# EAGLE schematic RH013.1 (EAGLE 7.1.0)
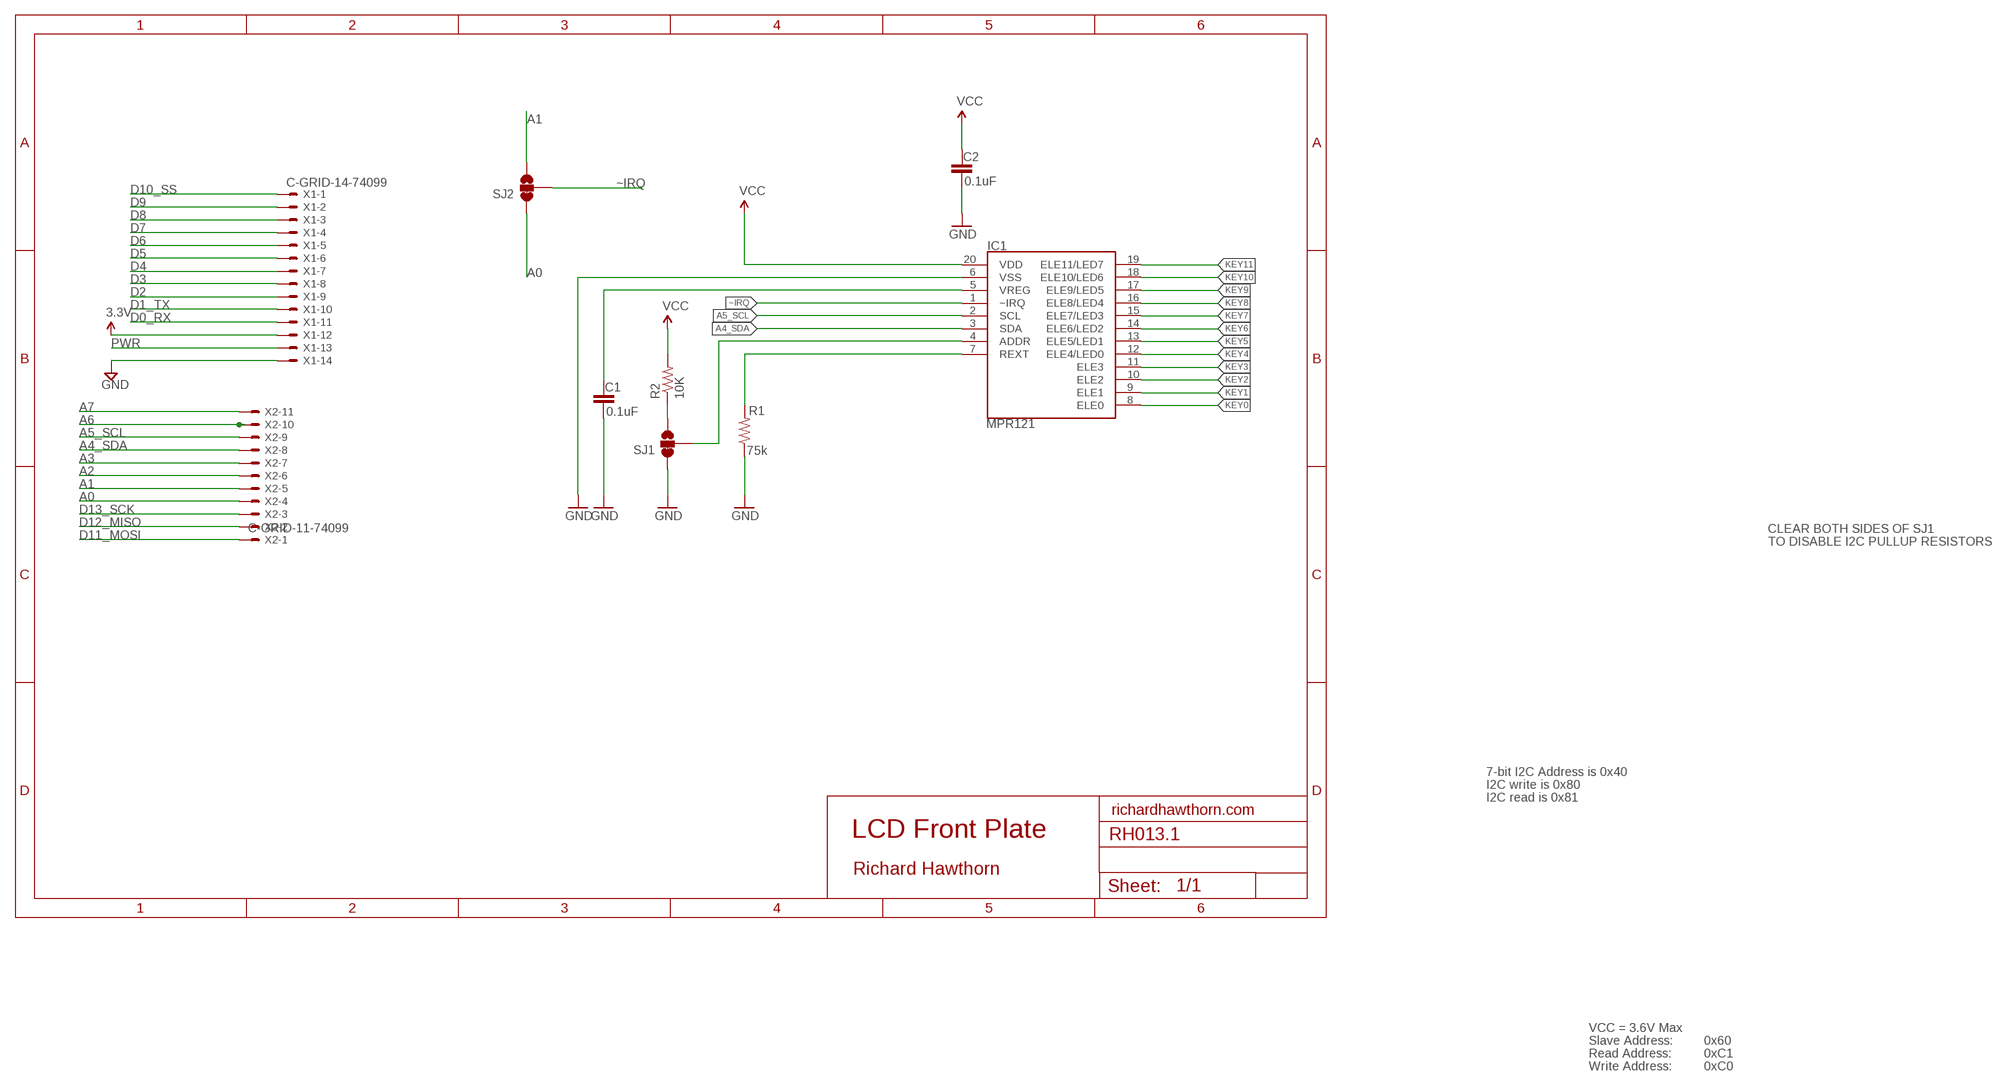
[diagram p0: schematic, sheet 1]

## Parts
C1  0.1uF  0.1UF-25V(+80/-20%)(0603)  [0603-CAP]
C2  0.1uF  0.1UF-25V(+80/-20%)(0603)  [0603-CAP]
IC1  MPR121  MPR121V2  [QFN-20-0.4MM-V2]
R1  75k  RESISTOR0603-RES  [0603-RES]
R2  10K  10KOHM1/10W1%(0603)0603  [0603-RES]
SJ1  SOLDERJUMPER_2WAYPASTE1&2  [SJ_3_PASTE1&2]
SJ2  SOLDERJUMPER_2WAYPASTE1&2  [SJ_3_PASTE1&2]
X1  C-GRID-14-74099  [74099-14]
X2  C-GRID-11-74099  [74099-11]

## Nets
3.3V: C2.1 IC1.20(VDD) R2.2 X1.12 ; supply symbol labelled VCC
A0: SJ2.1 X2.4
A1: SJ2.3 X2.5
A2: X2.6
A3: X2.7
A4_SDA: IC1.3(SDA) X2.8
A5_SCL: IC1.2(SCL) X2.9
A6: X2.10
A7: X2.11
D0_RX: X1.11
D1_TX: X1.10
D2: X1.9
D3: X1.8
D4: X1.7
D5: X1.6
D6: X1.5
D7: X1.4
D8: X1.3
D9: X1.2
D10_SS: X1.1
D11_MOSI: X2.1
D12_MISO: X2.2
D13_SCK: X2.3
GND [power]: C1.2 C2.2 IC1.6(VSS) R1.1 SJ1.1 X1.14
KEY0: IC1.8(ELE0)
KEY1: IC1.9(ELE1)
KEY2: IC1.10(ELE2)
KEY3: IC1.11(ELE3)
KEY4: IC1.12(ELE4/LED0)
KEY5: IC1.13(ELE5/LED1)
KEY6: IC1.14(ELE6/LED2)
KEY7: IC1.15(ELE7/LED3)
KEY8: IC1.16(ELE8/LED4)
KEY9: IC1.17(ELE9/LED5)
KEY10: IC1.18(ELE10/LED6)
KEY11: IC1.19(ELE11/LED7)
N$1: IC1.4(ADDR) SJ1.2
N$2: R2.1 SJ1.3
PWR [power]: X1.13
REXT: IC1.7(REXT) R1.2
VREG: C1.1 IC1.5(VREG)
~IRQ: IC1.1(~IRQ) SJ2.2

## Notes on the sheet
- CLEAR BOTH SIDES OF SJ1
- TO DISABLE I2C PULLUP RESISTORS
- 7-bit I2C Address is 0x40
- I2C write is 0x80
- I2C read is 0x81
- richardhawthorn.com
- LCD Front Plate
- Richard Hawthorn
- VCC = 3.6V Max
- Slave Address: | 0x60
- Read Address: | 0xC1
- Write Address: | 0xC0

## Library data of the parts
C1 C2 = SparkFun-Capacitors:0.1UF-25V(+80/-20%)(0603): Ceramic Standard decoupling cap CAP-00810; PROD_ID: CAP-00810
IC1 = SparkFun-Sensors:MPR121: MPR121 Capacitive Touch Sensor Controller. Variant "V2" was created using an image import of the bottom of the IC. It matches metal to metal.
R1 = SparkFun:RESISTOR: Resistor Basic schematic elements and footprints for 0603, 1206, and PTH 1/10th watt (small) resistors.
R2 = SparkFun-Resistors:10KOHM1/10W1%(0603): RES-00824; PROD_ID: RES-00824
SJ1 SJ2 = SparkFun-Passives:SOLDERJUMPER_2WAY: Solder Jumper 2 way solder jumper
X1 = con-molex:C-GRID-14: CONNECTOR wire to board 2.54 mm (0.100") pitch header; OC_FARNELL: unknown; OC_NEWARK: unknown
X2 = con-molex:C-GRID-11: CONNECTOR wire to board 2.54 mm (0.100") pitch header; OC_FARNELL: unknown; OC_NEWARK: unknown

## Net classes
1 power: width 0.381 mm, clearance 0.254 mm